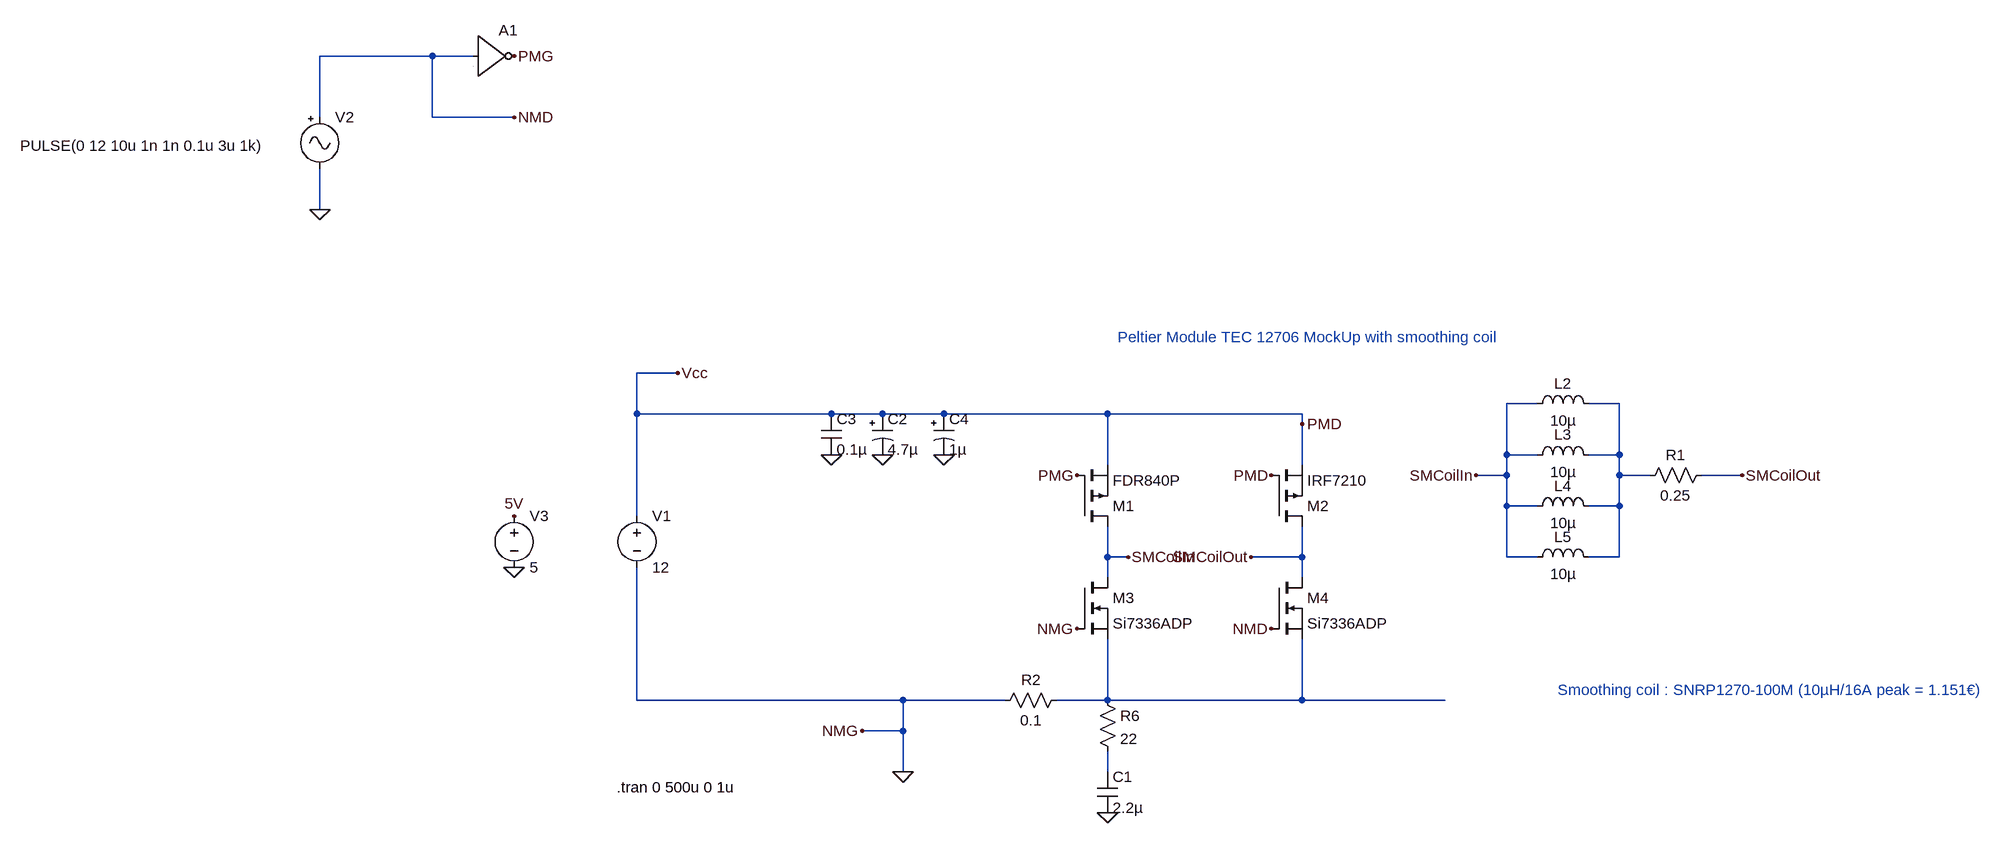
[diagram p0: schematic HBridge_SmoothPeltierModules_v2.asc]
HBridge_SmoothPeltierModules_v2.asc, the LTspice schematic file:
Version 4
SHEET 1 1520 680
WIRE -960 -576 -1136 -576
WIRE -896 -576 -960 -576
WIRE -1136 -480 -1136 -576
WIRE -960 -480 -960 -576
WIRE -832 -480 -960 -480
WIRE -1136 -336 -1136 -400
WIRE -576 -80 -640 -80
WIRE 768 -32 720 -32
WIRE 896 -32 848 -32
WIRE -640 -16 -640 -80
WIRE -336 -16 -640 -16
WIRE -256 -16 -336 -16
WIRE -160 -16 -256 -16
WIRE 96 -16 -160 -16
WIRE 400 -16 96 -16
WIRE 400 0 400 -16
WIRE 720 48 720 -32
WIRE 768 48 720 48
WIRE 896 48 896 -32
WIRE 896 48 848 48
WIRE 96 64 96 -16
WIRE 400 64 400 0
WIRE 720 80 720 48
WIRE 720 80 672 80
WIRE 896 80 896 48
WIRE 944 80 896 80
WIRE 1088 80 1024 80
WIRE 720 128 720 80
WIRE 768 128 720 128
WIRE 896 128 896 80
WIRE 896 128 848 128
WIRE -640 144 -640 -16
WIRE 96 208 96 160
WIRE 128 208 96 208
WIRE 400 208 400 160
WIRE 400 208 320 208
WIRE 720 208 720 128
WIRE 768 208 720 208
WIRE 896 208 896 128
WIRE 896 208 848 208
WIRE 96 240 96 208
WIRE 400 240 400 208
WIRE -640 432 -640 224
WIRE -224 432 -640 432
WIRE -64 432 -224 432
WIRE 96 432 96 336
WIRE 96 432 16 432
WIRE 400 432 400 336
WIRE 400 432 96 432
WIRE 624 432 400 432
WIRE -224 480 -224 432
WIRE -224 480 -288 480
WIRE -224 544 -224 480
WIRE 96 544 96 512
FLAG 48 80 PMG
FLAG 48 320 NMG
FLAG 352 320 NMD
FLAG 352 80 PMD
FLAG -224 544 0
FLAG -288 480 NMG
FLAG 400 0 PMD
FLAG -576 -80 Vcc
FLAG -1136 -336 0
FLAG 96 608 0
FLAG -832 224 0
FLAG -832 144 5V
FLAG -256 48 0
FLAG -336 48 0
FLAG -160 48 0
FLAG -832 -576 PMG
FLAG -832 -480 NMD
FLAG 672 80 SMCoilIn
FLAG 1088 80 SMCoilOut
FLAG 128 208 SMCoilIn
FLAG 320 208 SMCoilOut
SYMBOL pmos 48 160 M180
SYMATTR InstName M1
SYMATTR Value FDR840P
SYMBOL pmos 352 160 M180
SYMATTR InstName M2
SYMATTR Value IRF7210
SYMBOL nmos 48 240 R0
SYMATTR InstName M3
SYMATTR Value Si7336ADP
SYMBOL nmos 352 240 R0
SYMATTR InstName M4
SYMATTR Value Si7336ADP
SYMBOL res 32 416 R90
WINDOW 0 0 56 VBottom 2
WINDOW 3 32 56 VTop 2
SYMATTR InstName R2
SYMATTR Value 0.1
SYMBOL voltage -640 128 R0
WINDOW 123 0 0 Left 0
WINDOW 39 24 124 Left 2
SYMATTR InstName V1
SYMATTR Value 12
SYMBOL Misc\\signal -1136 -496 R0
WINDOW 123 0 0 Left 0
WINDOW 39 0 0 Left 0
WINDOW 3 -468 60 Left 2
SYMATTR Value PULSE(0 12 10u 1n 1n 0.1u 3u 1k)
SYMATTR InstName V2
SYMBOL cap 80 544 R0
SYMATTR InstName C1
SYMATTR Value 2.2µ
SYMBOL res 80 416 R0
SYMATTR InstName R6
SYMATTR Value 22
SYMBOL voltage -832 128 R0
WINDOW 123 0 0 Left 0
WINDOW 39 0 0 Left 0
SYMATTR InstName V3
SYMATTR Value 5
SYMBOL polcap -272 -16 R0
WINDOW 3 24 56 Left 2
SYMATTR InstName C2
SYMATTR Value 4.7µ
SYMATTR Description Capacitor
SYMATTR Type cap
SYMATTR SpiceLine V=25 Irms=24m Rser=5 Lser=0 mfg="Nichicon" pn="UPR1E4R7MAH" type="Al electrolytic"
SYMBOL cap -352 -16 R0
SYMATTR InstName C3
SYMATTR Value 0.1µ
SYMATTR SpiceLine V=25 Irms=2.1 Rser=0.0606238 Lser=0 mfg="KEMET" pn="C1210C104K3RAC" type="X7R"
SYMBOL polcap -176 -16 R0
WINDOW 3 24 56 Left 2
SYMATTR InstName C4
SYMATTR Value 1µ
SYMATTR Description Capacitor
SYMATTR Type cap
SYMATTR SpiceLine V=50 Irms=36m Rser=3.5 Lser=0 mfg="Nichicon" pn="UPL1H010MAH" type="Al electrolytic"
SYMBOL Digital\\inv -896 -640 R0
SYMATTR InstName A1
SYMBOL ind 752 -16 R270
WINDOW 0 32 56 VTop 2
WINDOW 3 5 56 VBottom 2
SYMATTR InstName L2
SYMATTR Value 10µ
SYMATTR SpiceLine Ipk=16 Rser=0.0168 Rpar=1879.44 Cpar=0 mfg="Bourns, Inc." pn="SRP1270-100M"
SYMBOL ind 752 64 R270
WINDOW 0 32 56 VTop 2
WINDOW 3 5 56 VBottom 2
SYMATTR InstName L3
SYMATTR Value 10µ
SYMATTR SpiceLine Ipk=16 Rser=0.0168 Rpar=1879.44 Cpar=0 mfg="Bourns, Inc." pn="SRP1270-100M"
SYMBOL ind 752 144 R270
WINDOW 0 32 56 VTop 2
WINDOW 3 5 56 VBottom 2
SYMATTR InstName L4
SYMATTR Value 10µ
SYMATTR SpiceLine Ipk=16 Rser=0.0168 Rpar=1879.44 Cpar=0 mfg="Bourns, Inc." pn="SRP1270-100M"
SYMBOL ind 752 224 R270
WINDOW 0 32 56 VTop 2
WINDOW 3 5 56 VBottom 2
SYMATTR InstName L5
SYMATTR Value 10µ
SYMATTR SpiceLine Ipk=16 Rser=0.0168 Rpar=1879.44 Cpar=0 mfg="Bourns, Inc." pn="SRP1270-100M"
SYMBOL res 1040 64 R90
WINDOW 0 0 56 VBottom 2
WINDOW 3 32 56 VTop 2
SYMATTR InstName R1
SYMATTR Value 0.25
TEXT -672 568 Left 2 !.tran 0 500u 0 1u
TEXT 112 -136 Left 2 ;Peltier Module TEC 12706 MockUp with smoothing coil
TEXT 800 416 Left 2 ;Smoothing coil : SNRP1270-100M (10µH/16A peak = 1.151€)

The netlist it stands for:
* HBridge_SmoothPeltierModules_v2.asc
M1 SMCoilIn PMG Vcc Vcc FDR840P
M2 SMCoilOut Vcc Vcc Vcc IRF7210
M3 SMCoilIn 0 N002 N002 Si7336ADP
M4 SMCoilOut NMD N002 N002 Si7336ADP
R2 N002 0 0.1
V1 Vcc 0 12
V2 NMD 0 PULSE(0 12 10u 1n 1n 0.1u 3u 1k)
C1 N003 0 2.2µ
R6 N002 N003 22
V3 5V 0 5
C2 Vcc 0 4.7µ V=25 Irms=24m Rser=5 Lser=0 mfg="Nichicon" pn="UPR1E4R7MAH" type="Al electrolytic"
C3 Vcc 0 0.1µ V=25 Irms=2.1 Rser=0.0606238 Lser=0 mfg="KEMET" pn="C1210C104K3RAC" type="X7R"
C4 Vcc 0 1µ V=50 Irms=36m Rser=3.5 Lser=0 mfg="Nichicon" pn="UPL1H010MAH" type="Al electrolytic"
A1 NMD 0 0 0 0 PMG 0 0 BUF
L2 SMCoilIn N001 10µ Ipk=16 Rser=0.0168 Rpar=1879.44 Cpar=0 mfg="Bourns, Inc." pn="SRP1270-100M"
L3 SMCoilIn N001 10µ Ipk=16 Rser=0.0168 Rpar=1879.44 Cpar=0 mfg="Bourns, Inc." pn="SRP1270-100M"
L4 SMCoilIn N001 10µ Ipk=16 Rser=0.0168 Rpar=1879.44 Cpar=0 mfg="Bourns, Inc." pn="SRP1270-100M"
L5 SMCoilIn N001 10µ Ipk=16 Rser=0.0168 Rpar=1879.44 Cpar=0 mfg="Bourns, Inc." pn="SRP1270-100M"
R1 SMCoilOut N001 0.25
.model NMOS NMOS
.model PMOS PMOS
.lib standard.mos
.tran 0 500u 0 1u
* Peltier Module TEC 12706 MockUp with smoothing coil
* Smoothing coil : SNRP1270-100M (10µH/16A peak = 1.151€)
.backanno
.end